# EAGLE design shield (EAGLE 8.2.0)
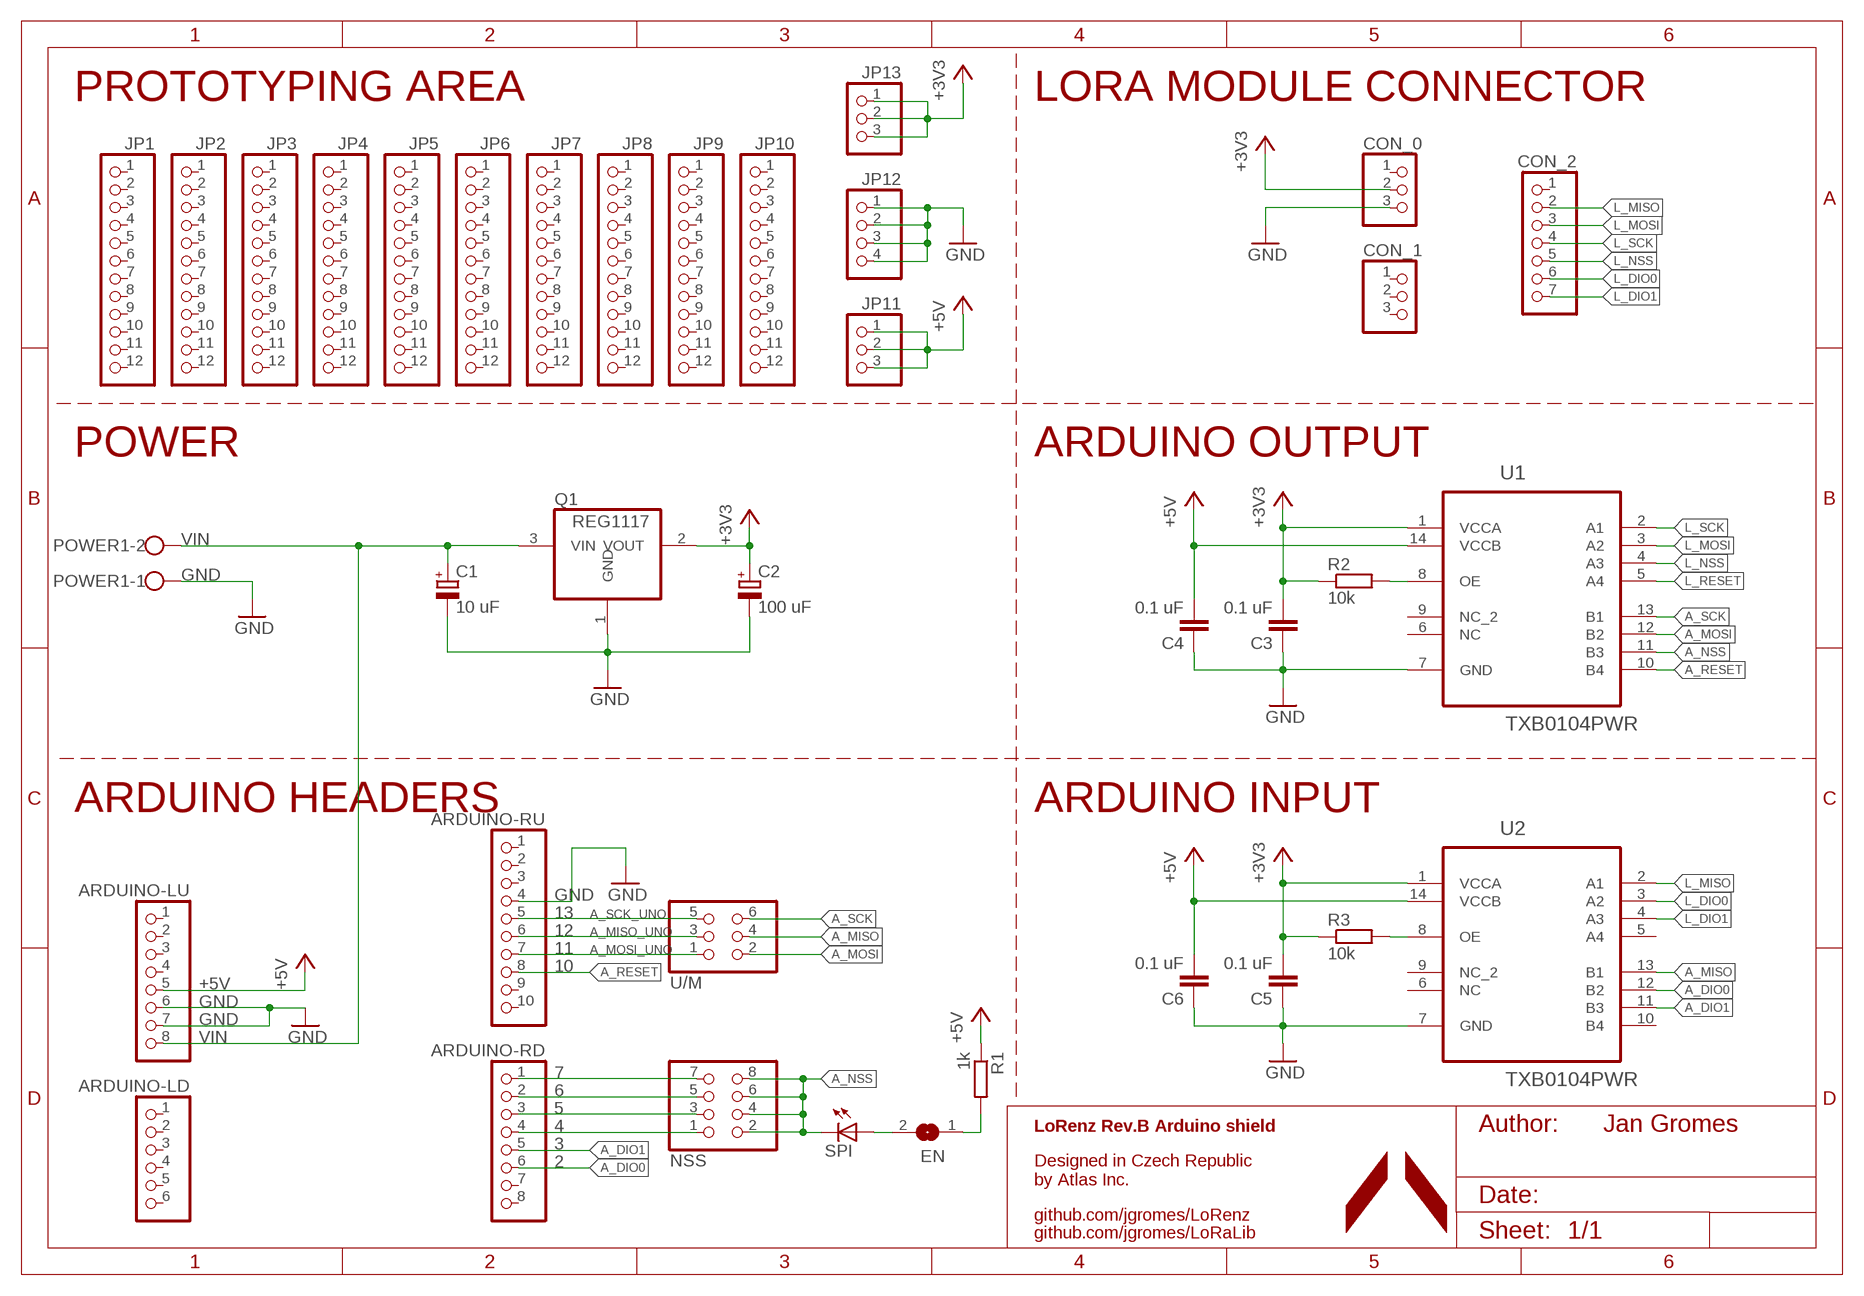
[diagram p0: schematic, sheet 1]

## Parts
ARDUINO-LD  PINHD-1X6  [1X06]
ARDUINO-LU  PINHD-1X8  [1X08]
ARDUINO-RD  PINHD-1X8  [1X08]
ARDUINO-RU  PINHD-1X10  [1X10]
C1  10 uF  CPOL-EUSMCA  [SMC_A]
C2  100 uF  CPOL-EUSMCB  [SMC_B]
C3  0.1 uF  C-EUC0603  [C0603]
C4  0.1 uF  C-EUC0603  [C0603]
C5  0.1 uF  C-EUC0603  [C0603]
C6  0.1 uF  C-EUC0603  [C0603]
CON_0  PINHD-1X3  [1X03]
CON_1  PINHD-1X3  [1X03]
CON_2  PINHD-1X7  [1X07]
EN  SJ  [SJ]
JP1  PINHD-1X12-CB  [1X12-CB]
JP2  PINHD-1X12-CB  [1X12-CB]
JP3  PINHD-1X12-CB  [1X12-CB]
JP4  PINHD-1X12-CB  [1X12-CB]
JP5  PINHD-1X12-CB  [1X12-CB]
JP6  PINHD-1X12-CB  [1X12-CB]
JP7  PINHD-1X12-CB  [1X12-CB]
JP8  PINHD-1X12-CB  [1X12-CB]
JP9  PINHD-1X12-CB  [1X12-CB]
JP10  PINHD-1X12-CB  [1X12-CB]
JP11  PINHD-1X3CB  [1X03-CLEANBIG]
JP12  PINHD-1X4  [1X04-CLEANBIG]
JP13  PINHD-1X3CB  [1X03-CLEANBIG]
NSS  PINHD-2X4  [2X04]
POWER1  W237-102  [W237-102]
Q1  REG1117  [SOT223]
R1  1k  R-EU_R0603  [R0603]
R2  10k  R-EU_R0603  [R0603]
R3  10k  R-EU_R0603  [R0603]
SPI  LEDSML0603  [SML0603]
U1  TXB0104PWR  [SOP65P640X120-14N]
U2  TXB0104PWR  [SOP65P640X120-14N]
U/M  PINHD-2X3  [2X03]

## Nets
+3V3: C2.+ C3.2 C5.2 CON_0.2 JP13.1 JP13.2 JP13.3 Q1.2(VOUT) R2.1 R3.1 U1.1(VCCA) U2.1(VCCA)
+5V: ARDUINO-LU.5 C4.2 C6.2 JP11.1 JP11.2 JP11.3 R1.1 U1.14(VCCB) U2.14(VCCB)
A_DIO0: ARDUINO-RD.6 U2.12(B2)
A_DIO1: ARDUINO-RD.5 U2.11(B3)
A_MISO: U2.13(B1) U/M.4
A_MISO_UNO: ARDUINO-RU.6 U/M.3
A_MOSI: U1.12(B2) U/M.2
A_MOSI_UNO: ARDUINO-RU.7 U/M.1
A_NSS: NSS.2 NSS.4 NSS.6 NSS.8 SPI.C U1.11(B3)
A_RESET: ARDUINO-RU.8 U1.10(B4)
A_SCK: U1.13(B1) U/M.6
A_SCK_UNO: ARDUINO-RU.5 U/M.5
GND: ARDUINO-LU.6 ARDUINO-LU.7 ARDUINO-RU.4 C1.- C2.- C3.1 C4.1 C5.1 C6.1 CON_0.3 JP12.1 JP12.2 JP12.3 JP12.4 POWER1.1 Q1.1(GND) U1.7(GND) U2.7(GND)
L_DIO0: CON_2.6 U2.3(A2)
L_DIO1: CON_2.7 U2.4(A3)
L_MISO: CON_2.2 U2.2(A1)
L_MOSI: CON_2.3 U1.3(A2)
L_NSS: CON_2.5 U1.4(A3)
L_RESET: U1.5(A4)
L_SCK: CON_2.4 U1.2(A1)
N$3: ARDUINO-RD.1 NSS.7
N$4: EN.2 SPI.A
N$5: ARDUINO-RD.2 NSS.5
N$6: ARDUINO-RD.3 NSS.3
N$7: ARDUINO-RD.4 NSS.1
N$10: EN.1 R1.2
N$11: R2.2 U1.8(OE)
N$12: R3.2 U2.8(OE)
VIN: ARDUINO-LU.8 C1.+ POWER1.2 Q1.3(VIN)
Unconnected: ARDUINO-LD.1 ARDUINO-LD.2 ARDUINO-LD.3 ARDUINO-LD.4 ARDUINO-LD.5 ARDUINO-LD.6 ARDUINO-LU.1 ARDUINO-LU.2 ARDUINO-LU.3 ARDUINO-LU.4 ARDUINO-RD.7 ARDUINO-RD.8 ARDUINO-RU.1 ARDUINO-RU.2 ARDUINO-RU.3 ARDUINO-RU.9 ARDUINO-RU.10 CON_0.1 CON_1.1 CON_1.2 CON_1.3 CON_2.1 JP1.1 JP1.2 JP1.3 JP1.4 JP1.5 JP1.6 JP1.7 JP1.8 JP1.9 JP1.10 JP1.11 JP1.12 JP2.1 JP2.2 JP2.3 JP2.4 JP2.5 JP2.6 JP2.7 JP2.8 JP2.9 JP2.10 JP2.11 JP2.12 JP3.1 JP3.2 JP3.3 JP3.4 JP3.5 JP3.6 JP3.7 JP3.8 JP3.9 JP3.10 JP3.11 JP3.12 JP4.1 JP4.2 JP4.3 JP4.4 JP4.5 JP4.6 JP4.7 JP4.8 JP4.9 JP4.10 JP4.11 JP4.12 JP5.1 JP5.2 JP5.3 JP5.4 JP5.5 JP5.6 JP5.7 JP5.8 JP5.9 JP5.10 JP5.11 JP5.12 JP6.1 JP6.2 JP6.3 JP6.4 JP6.5 JP6.6 JP6.7 JP6.8 JP6.9 JP6.10 JP6.11 JP6.12 JP7.1 JP7.2 JP7.3 JP7.4 JP7.5 JP7.6 JP7.7 JP7.8 JP7.9 JP7.10 JP7.11 JP7.12 JP8.1 JP8.2 JP8.3 JP8.4 JP8.5 JP8.6 JP8.7 JP8.8 JP8.9 JP8.10 JP8.11 JP8.12 JP9.1 JP9.2 JP9.3 JP9.4 JP9.5 JP9.6 JP9.7 JP9.8 JP9.9 JP9.10 JP9.11 JP9.12 JP10.1 JP10.2 JP10.3 JP10.4 JP10.5 JP10.6 JP10.7 JP10.8 JP10.9 JP10.10 JP10.11 JP10.12 U1.6(NC) U1.9(NC_2) U2.5(A4) U2.6(NC) U2.9(NC_2) U2.10(B4)

## Notes on the sheet
- PROTOTYPING AREA | LORA MODULE CONNECTOR
- POWER | ARDUINO OUTPUT
- ARDUINO HEADERS | ARDUINO INPUT
- 13
- 12
- 11
- 10
- 7
- 6
- 5
- 4 | LoRenz Rev.B Arduino shield | Jan Gromes
- 3
- 2
- Designed in Czech Republic
  by Atlas Inc.
- github.com/jgromes/LoRenz
- github.com/jgromes/LoRaLib
- C:/Users/Honza/Desktop/ATLAS/atlas_logo_notext_gs.bmp

## Library data of the parts
ARDUINO-LD = pinhead:PINHD-1X6: PIN HEADER
ARDUINO-LU ARDUINO-RD = pinhead:PINHD-1X8: PIN HEADER
ARDUINO-RU = pinhead:PINHD-1X10: PIN HEADER
C1 C2 = rcl:CPOL-EU: POLARIZED CAPACITOR, European symbol
C3-C6 = rcl:C-EU: CAPACITOR, European symbol
CON_0 CON_1 = pinhead:PINHD-1X3: PIN HEADER
CON_2 = pinhead:PINHD-1X7: PIN HEADER
EN = jumper:SJ: SMD solder JUMPER
JP1-JP10 = adafruit:PINHD-1X12: PIN HEADER
JP11 JP13 = adafruit:PINHD-1X3: PIN HEADER
JP12 = adafruit:PINHD-1X4
NSS = pinhead:PINHD-2X4: PIN HEADER
POWER1 = con-wago-500:W237-102: WAGO SCREW CLAMP; MPN: 237-102; OC_FARNELL: unknown; OC_NEWARK: 70K9898
Q1 = burr-brown:REG1117: 800mA and 1A Low Dropout (LDO) Positive Regulator 1.8V, 2.5V, 2.85V, 3.3V, 5V, and Adj; MPN: REG1117; OC_FARNELL: 1097566; OC_NEWARK: 14P6981
R1-R3 = rcl:R-EU_: RESISTOR, European symbol
SPI = led:LED: LED OSRAM: - CHIPLED LG R971, LG N971, LY N971, LG Q971, LY Q971, LO R971, LY R971 LH N974, LH R974 LS Q976, LO Q976, LY Q976 LO Q996 - Hyper CHIPLED LW Q18S LB Q993, LB Q99A, LB R99A - SideLED LS A670, LO A670, LY A670, LG A670, LP A670 LB A673, LV A673, LT A673, LW A673 LH A674 LY A675 LS A676, LA A676, LO A676, LY A676, LW A676 LS A679, LY A679, LG A679 - Hyper Micro SIDELED® LS Y876, LA Y876, LO Y876, LY Y876 LT Y87S - SmartLED LW L88C, LW L88S LB L89C, LB L89S, LG L890 LS L89K, LO L89K, LY L89K LS L896, LA L896, LO L896, LY L896 - TOPLED LS T670, LO T670, LY T670, LG T670, LP T670 LSG T670, LSP T670, LSY T670, LOP T670, LYG T670 LG T671, LOG T671, LSG T671 LB T673, LV T673, LT T673, LW T673 LH T674 LS T676, LA T676, LO T676, LY T676, LB T676, LH T676, LSB T676, LW T676 LB T67C, LV T67C, LT T67C, LS T67K, LO T67K, LY T67K, LW E67C LS E67B, LA E67B, LO E67B, LY E67B, LB E67C, LV E67C, LT E67C LW T67C LS T679, LY T679, LG T679 LS T770, LO T770, LY T770, LG T770, LP T770 LB T773, LV T773, LT T773, LW T773 LH T774 LS E675, LA E675, LY E675, LS T675 LS T776, LA T776, LO T776, LY T776, LB T776 LHGB T686 LT T68C, LB T68C - Hyper Mini TOPLED® LB M676 - Mini TOPLED Santana® LG M470 LS M47K, LO M47K, LY M47K Source: http://www.osram.convergy.de LUXEON: - LUMILED® LXK2-PW12-R00, LXK2-PW12-S00, LXK2-PW14-U00, LXK2-PW14-V00 LXK2-PM12-R00, LXK2-PM12-S00, LXK2-PM14-U00 LXK2-PE12-Q00, LXK2-PE12-R00, LXK2-PE12-S00, LXK2-PE14-T00, LXK2-PE14-U00 LXK2-PB12-K00, LXK2-PB12-L00, LXK2-PB12-M00, LXK2-PB14-N00, LXK2-PB14-P00, LXK2-PB14-Q00 LXK2-PR12-L00, LXK2-PR12-M00, LXK2-PR14-Q00, LXK2-PR14-R00 LXK2-PD12-Q00, LXK2-PD12-R00, LXK2-PD12-S00 LXK2-PH12-R00, LXK2-PH12-S00 LXK2-PL12-P00, LXK2-PL12-Q00, LXK2-PL12-R00 Source: www.luxeon.com KINGBRIGHT: KA-3528ASYC Source: www.kingbright.com
U1 U2 = Texas Instruments_By_element14_Batch_1:TXB0104PWR: 4-BIT BIDIRECTIONAL VOLTAGE-LEVEL TRANSLATOR; MPN: TXB0104PWR; OC_FARNELL: 1607891; OC_NEWARK: 99K4466; PACKAGE: TSSOP-14; SUPPLIER: Texas Instruments
U/M = pinhead:PINHD-2X3: PIN HEADER

## Board
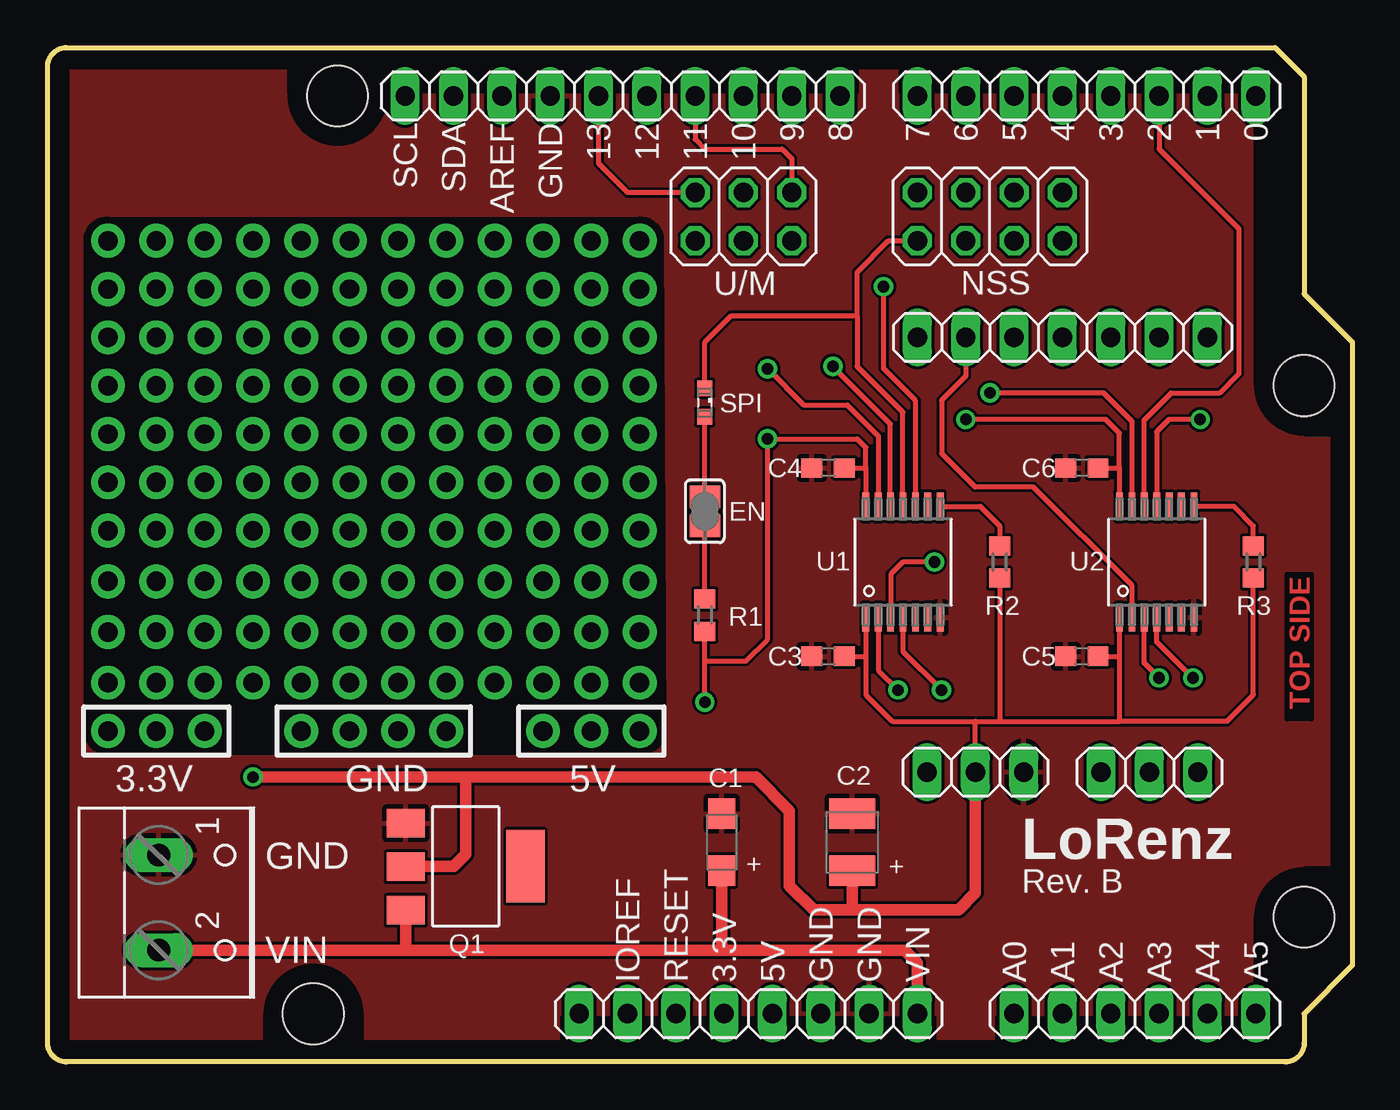
[diagram p1: board, top side]
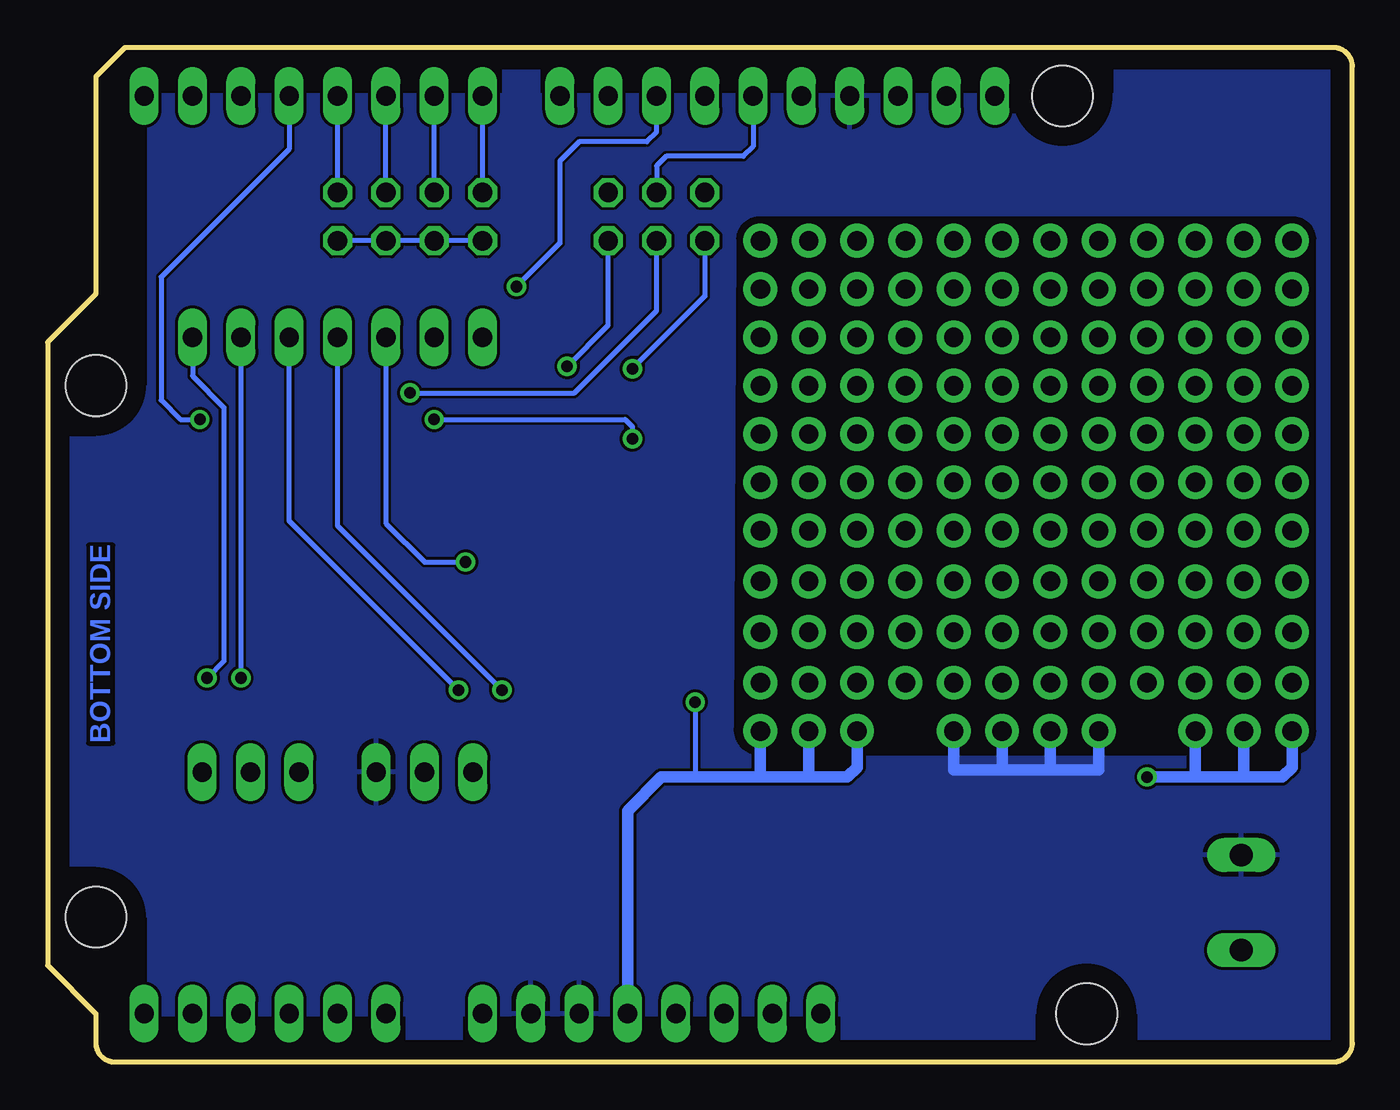
[diagram p2: board, bottom side, seen from below]

Size 68.58 x 53.34 mm. Coordinates in mm from the lower left corner, seen from the top.
Outline: 64.52,53.34 66.04,51.82 66.04,40.39 68.58,37.85 68.58,5.08 66.04,2.54 66.04,1 arc-90 65.04,0 1,0 arc-90 0,1 0,52.34 arc-90 1,53.34 64.52,53.34
Copper layers (1*16): Top 0.035mm / dielectric 1.5mm / Bottom 0.035mm
Design rules "default *": minimum track width 10mil, minimum drill 0.6mm, track to track 6mil, track to pad 6mil, pad to pad 6mil, via to via 6mil, smd to smd 6mil, copper to edge 40mil, drill to drill 8mil, minimum pad ring 10mil, minimum via ring 8mil, stop-mask expansion 4mil, vias tented up to drill 0mil, thermal gap 10mil
Holes 3.2 mm at 66.04,35.56 66.04,7.62 15.24,50.8 13.97,2.54

### Footprints (pad centres in the part's own frame; a part is rotated, then mirrored left to right if it is on the bottom)
1X06 = drill 1.016 long: 1 -6.35,0; 2 -3.81,0; 3 -1.27,0; 4 1.27,0; 5 3.81,0; 6 6.35,0
1X08 = drill 1.016 long: 1 -8.89,0; 2 -6.35,0; 3 -3.81,0; 4 -1.27,0; 5 1.27,0; 6 3.81,0; 7 6.35,0; 8 8.89,0
1X10 = drill 1.016 long: 1 -11.43,0; 2 -8.89,0; 3 -6.35,0; 4 -3.81,0; 5 -1.27,0; 6 1.27,0; 7 3.81,0; 8 6.35,0; 9 8.89,0; 10 11.43,0
SMC_A = smd 1.6 x 1.4: + -1.5,0; - 1.5,0
SMC_B = smd 1.6 x 2.4: + -1.5,0; - 1.5,0
C0603 = smd 1.1 x 1: 1 -0.85,0; 2 0.85,0
1X03 = drill 1.016 long: 1 -2.54,0; 2 0,0; 3 2.54,0
1X07 = drill 1.016 long: 1 -7.62,0; 2 -5.08,0; 3 -2.54,0; 4 0,0; 5 2.54,0; 6 5.08,0; 7 7.62,0
SJ = smd 1.168 x 1.6: 1 -0.762,0; 2 0.762,0
1X12-CB = drill 1.016 pad 1.778: 1 -13.97,0; 2 -11.43,0; 3 -8.89,0; 4 -6.35,0; 5 -3.81,0; 6 -1.27,0; 7 1.27,0; 8 3.81,0; 9 6.35,0; 10 8.89,0; 11 11.43,0; 12 13.97,0
1X03-CLEANBIG = drill 1.016 pad 1.778: 1 -2.54,0; 2 0,0; 3 2.54,0
1X04-CLEANBIG = drill 1.016 pad 1.778: 1 -3.81,0; 2 -1.27,0; 3 1.27,0; 4 3.81,0
2X04 = drill 1.016 octagon: 1 -3.81,-1.27; 2 -3.81,1.27; 3 -1.27,-1.27; 4 -1.27,1.27; 5 1.27,-1.27; 6 1.27,1.27; 7 3.81,-1.27; 8 3.81,1.27
W237-102 = drill 1.194 long: 1 -2.5,-1.27; 2 2.5,-1.27
SOT223 = smd 1.499 x 2.007: 1 -2.261,-3.15; 2 0.025,-3.15; 3 2.311,-3.15 | smd 3.81 x 2.007: 4 0,3.15
R0603 = smd 1 x 1.1: 1 -0.85,0; 2 0.85,0
SML0603 = smd 0.8 x 0.8: A 0.75,0; C -0.75,0
SOP65P640X120-14N = smd 1.473 x 0.356: 1 -2.921,1.956; 2 -2.921,1.295; 3 -2.921,0.66; 4 -2.921,0; 5 -2.921,-0.66; 6 -2.921,-1.295; 7 -2.921,-1.956; 8 2.921,-1.956; 9 2.921,-1.295; 10 2.921,-0.66; 11 2.921,0; 12 2.921,0.66; 13 2.921,1.295; 14 2.921,1.956
2X03 = drill 1.016 octagon: 1 -2.54,-1.27; 2 -2.54,1.27; 3 0,-1.27; 4 0,1.27; 5 2.54,-1.27; 6 2.54,1.27

### Placement (x,y rotation side)
ARDUINO-LD  57.15,2.54 0 top
ARDUINO-LU  36.83,2.54 0 top
ARDUINO-RD  54.61,50.8 0 top
ARDUINO-RU  30.23,50.8 0 top
C1  35.43,11.56 90 top
C2  42.29,11.56 90 top
C3  41.02,21.34 0 top
C4  41.02,31.24 0 top
C5  54.36,21.34 0 top
C6  54.36,31.24 0 top
CON_0  48.77,15.24 0 top
CON_1  57.91,15.24 0 top
CON_2  53.34,38.1 0 top
EN  34.54,28.96 90 top
JP1  17.14,43.18 0 top
JP2  17.14,40.64 0 top
JP3  17.14,38.1 0 top
JP4  17.14,35.56 0 top
JP5  17.14,33.02 0 top
JP6  17.14,30.48 0 top
JP7  17.14,27.94 0 top
JP8  17.14,25.27 0 top
JP9  17.14,22.61 0 top
JP10  17.14,19.94 0 top
JP11  28.58,17.4 0 top
JP12  17.14,17.4 0 top
JP13  5.71,17.4 0 top
NSS  49.53,44.45 180 top
POWER1  7.11,8.38 270 top
Q1  21.97,10.29 270 top
R1  34.54,23.5 90 top
R2  50.04,26.29 90 top
R3  63.37,26.29 90 top
SPI  34.54,34.67 270 top
U1  44.96,26.29 90 top
U2  58.29,26.29 90 top
U/M  36.58,44.45 180 top

### Tracks (layer width: path | path; a pad name or v marks a point on that pad's centre or on a via)
+3V3  (via drill 0.6)
  Top 0.254: R3.1 63.37,19.3 61.98,17.91 56.34,17.91 | U1.1 43,21.34 | C3.2 43,21.34 | U2.1 56.34,21.34 | C5.2 56.34,21.34 | R2.1 50.04,17.91 | 56.34,21.34 56.34,17.91 | 50.04,17.91 56.34,17.91 | 48.77,17.91 44.4,17.91 43,19.3 43,21.34 | 48.77,17.91 50.04,17.91 | CON_0.2 48.77,17.91
  Top 0.61: 21.97,14.99 21.97,10.92 21.34,10.29 18.85,10.29 Q1.2 | v10.79,14.99 21.97,14.99 | 21.97,14.99 37.21,14.99 38.99,13.21 38.99,9.27 40.26,8 42.29,8 | C2.+ 42.29,8 | 42.29,8 47.88,8 48.77,8.89 CON_0.2
  Bottom 0.61: JP13.1 3.17,15.49 3.68,14.99 5.71,14.99 | 5.71,14.99 8.25,14.99 | 8.25,14.99 v10.79,14.99 | JP13.3 8.25,14.99 | JP13.2 5.71,14.99
+5V  (via drill 0.61)
  Top 0.254: v34.54,18.92 34.54,21.08 | 34.54,21.08 R1.1 | 43,31.24 U1.14 | 43,31.24 43,32.31 42.54,32.77 v37.85,32.77 37.85,22.23 36.7,21.08 34.54,21.08 | C4.2 43,31.24 | 56.34,31.24 U2.14 | 56.34,31.24 56.34,33.07 55.63,33.78 v48.26,33.78 | C6.2 56.34,31.24
  Bottom 0.254: v48.26,33.78 38.23,33.78 37.85,33.4 v37.85,32.77 | v34.54,18.92 34.54,14.99
  Bottom 0.61: 28.58,14.99 JP11.2 | ARDUINO-LU.5 38.1,13.21 36.32,14.99 34.54,14.99 31.12,14.99 | JP11.1 26.04,15.49 26.54,14.99 28.58,14.99 | 28.58,14.99 31.12,14.99 | JP11.3 31.12,14.99
A_DIO0
  Top 0.254: ARDUINO-RD.6 58.42,48.01 62.61,43.81 62.61,36.2 61.59,35.18 59.05,35.18 57.63,33.76 U2.12
A_DIO1  (via drill 0.61)
  Top 0.254: v60.58,33.78 58.93,33.78 58.29,33.15 U2.11
  Bottom 0.254: ARDUINO-RD.5 55.88,48.01 62.61,41.27 62.61,34.8 61.59,33.78 v60.58,33.78
A_MISO  (via drill 0.61)
  Top 0.254: v49.53,35.18 55.5,35.18 57,33.68 U2.13
  Bottom 0.254: v49.53,35.18 40.89,35.18 36.58,39.5 U/M.4
A_MISO_UNO
  Bottom 0.254: ARDUINO-RU.6 31.5,48.13 32,47.62 36.07,47.62 36.58,47.12 U/M.3
A_MOSI  (via drill 0.61)
  Top 0.254: U1.12 44.3,33.55 v41.27,36.58
  Bottom 0.254: v41.27,36.58 39.12,38.73 U/M.2
A_MOSI_UNO
  Top 0.254: ARDUINO-RU.7 34.04,48.51 34.54,48.01 38.61,48.01 39.12,47.5 U/M.1
A_NSS
  Top 0.254: U1.11 44.96,34.16 42.54,36.58 42.54,39.24 | SPI.C 34.54,37.85 35.94,39.24 42.54,39.24 | 42.54,39.24 42.54,41.53 44.2,43.18 NSS.8
  Bottom 0.254: NSS.8 NSS.6 NSS.4 NSS.2
A_RESET  (via drill 0.61)
  Top 0.254: U1.10 45.62,34.77 43.94,36.45 v43.94,40.77
  Bottom 0.254: ARDUINO-RU.8 36.58,48.89 37.08,48.39 40.64,48.39 41.66,47.37 41.66,43.05 v43.94,40.77
A_SCK  (via drill 0.61)
  Top 0.254: v37.85,36.45 39.75,34.54 42.04,34.54 43.66,32.92 U1.13
  Bottom 0.254: U/M.6 34.04,40.26 v37.85,36.45
A_SCK_UNO
  Top 0.254: U/M.5 30.48,45.72 28.96,47.24 ARDUINO-RU.5
GND
  Bottom 0.61: JP12.1 13.33,15.37 15.87,15.37 | JP12.2 15.87,15.37 | JP12.3 18.42,15.37 | 18.42,15.37 15.87,15.37 | JP12.4 20.96,15.37 18.42,15.37
  pour Bottom: -0.38,53.72 12.45,53.72 12.45,50.8 42.8,50.8 42.8,53.72 44.58,53.72 44.58,50.8 63.25,50.8 63.25,35.43 65.91,35.43 65.91,32.77 68.96,32.77 68.96,10.41 65.91,10.41 65.91,7.75 63.25,7.75 63.25,2.54 49.66,2.54 49.66,-0.25 46.86,-0.25 46.86,2.54 26.8,2.54 26.8,-0.38 16.76,-0.38 16.76,2.67 11.18,2.67 11.18,-0.38 -0.38,-0.38
  pour Top: -0.64,53.97 12.45,53.97 12.45,50.8 42.8,50.8 42.8,53.97 44.58,53.97 44.58,50.8 63.25,50.8 63.25,35.43 65.91,35.43 65.91,32.77 69.22,32.77 69.22,10.41 65.91,10.41 65.91,7.75 63.25,7.75 63.25,2.54 49.66,2.54 49.66,-0.51 46.86,-0.51 46.86,2.54 26.8,2.54 26.8,-0.64 16.76,-0.64 16.76,2.67 11.18,2.67 11.18,-0.64 -0.64,-0.64
L_DIO0  (via drill 0.61)
  Top 0.254: v58.42,20.19 57.63,20.98 U2.3
  Bottom 0.254: CON_2.6 v58.42,20.19
L_DIO1  (via drill 0.61)
  Top 0.254: v60.2,20.19 58.29,22.1 U2.4
  Bottom 0.254: CON_2.7 60.96,36.07 59.31,34.42 59.31,21.08 v60.2,20.19
L_MISO
  Top 0.254: CON_2.2 48.26,36.07 46.99,34.8 46.99,32 48.77,30.23 51.82,30.23 57,25.04 U2.2
L_MOSI  (via drill 0.61)
  Top 0.254: v46.61,26.29 44.96,26.29 44.32,25.65 44.32,23.39 U1.3
  Bottom 0.254: CON_2.3 50.8,28.32 48.77,26.29 v46.61,26.29
L_NSS  (via drill 0.61)
  Top 0.254: U1.4 44.96,21.59 v46.99,19.56
  Bottom 0.254: v46.99,19.56 55.88,28.45 CON_2.5
L_SCK  (via drill 0.61)
  Top 0.254: U1.2 43.66,20.6 v44.7,19.56
  Bottom 0.254: v44.7,19.56 53.34,28.19 CON_2.4
N$1
  cutout Top: 3.17,44.32 31.12,44.32 arc-90 32.26,43.31 32.38,17.53 arc-90 31.24,16.26 3.17,16.26 arc-90 2.03,17.4 2.03,43.31 arc-90
N$2
  cutout Bottom: 3.17,44.32 31.12,44.32 arc-90 32.26,43.31 32.38,17.53 arc-90 31.24,16.26 3.17,16.26 arc-90 2.03,17.4 2.03,43.31 arc-90
N$3
  Bottom 0.254: NSS.7 ARDUINO-RD.1
N$4
  Top 0.254: EN.2 SPI.A
N$5
  Bottom 0.254: NSS.5 ARDUINO-RD.2
N$6
  Bottom 0.254: NSS.3 ARDUINO-RD.3
N$7
  Bottom 0.254: NSS.1 ARDUINO-RD.4
N$8
  cutout Bottom: 66.42,27.18 66.42,16.76 65.15,16.76 65.15,27.18
N$9
  cutout Top: 66.42,25.65 66.42,18.03 65.15,18.03 65.15,25.65
N$10
  Top 0.254: R1.2 EN.1
N$11
  Top 0.254: U1.8 49.02,29.21 50.04,28.19 R2.2
N$12
  Top 0.254: R3.2 63.37,28.19 62.36,29.21 U2.8
VIN
  Top 0.61: 35.43,5.88 45.04,5.88 45.72,5.21 ARDUINO-LU.8 | 35.43,5.88 18.82,5.88 | 18.82,5.88 POWER1.2 | Q1.3 18.82,5.88 | C1.+ 35.43,5.88

### Text on the board
Top: TOP SIDE
Bottom: BOTTOM SIDE
tNames: SCL | SDA | AREF | GND | 13 | 12 | 11 | 10 | 9 | 8 | 7 | 6 | 5 | 4 | 3 | 2 | 1 | 0 | 3.3V | GND | 5V | LoRenz | GND | + | + | Rev. B | VIN | IOREF | RESET | 3.3V | 5V | GND | GND | VIN | A0 | A1 | A2 | A3 | A4 | A5
200bmp: C:/Users/Honza/Desktop/ATLAS/atlas_logo_notext_gs.bmp